# EasyEDA Pro project BLDCV6-nerdyintern.eprj, schematic Schematic2
Create Date: 2024-09-26; Page Name: P1; Project Name: BLDCV6; Schematic Name: Schematic2; Update Date: 2024-09-26; Company: EasyEDA.com; Drawn: EasyEDA; Page Size: A4; Part Number: JLCPCB-002; Reviewed: EasyEDA; Version: V0.1
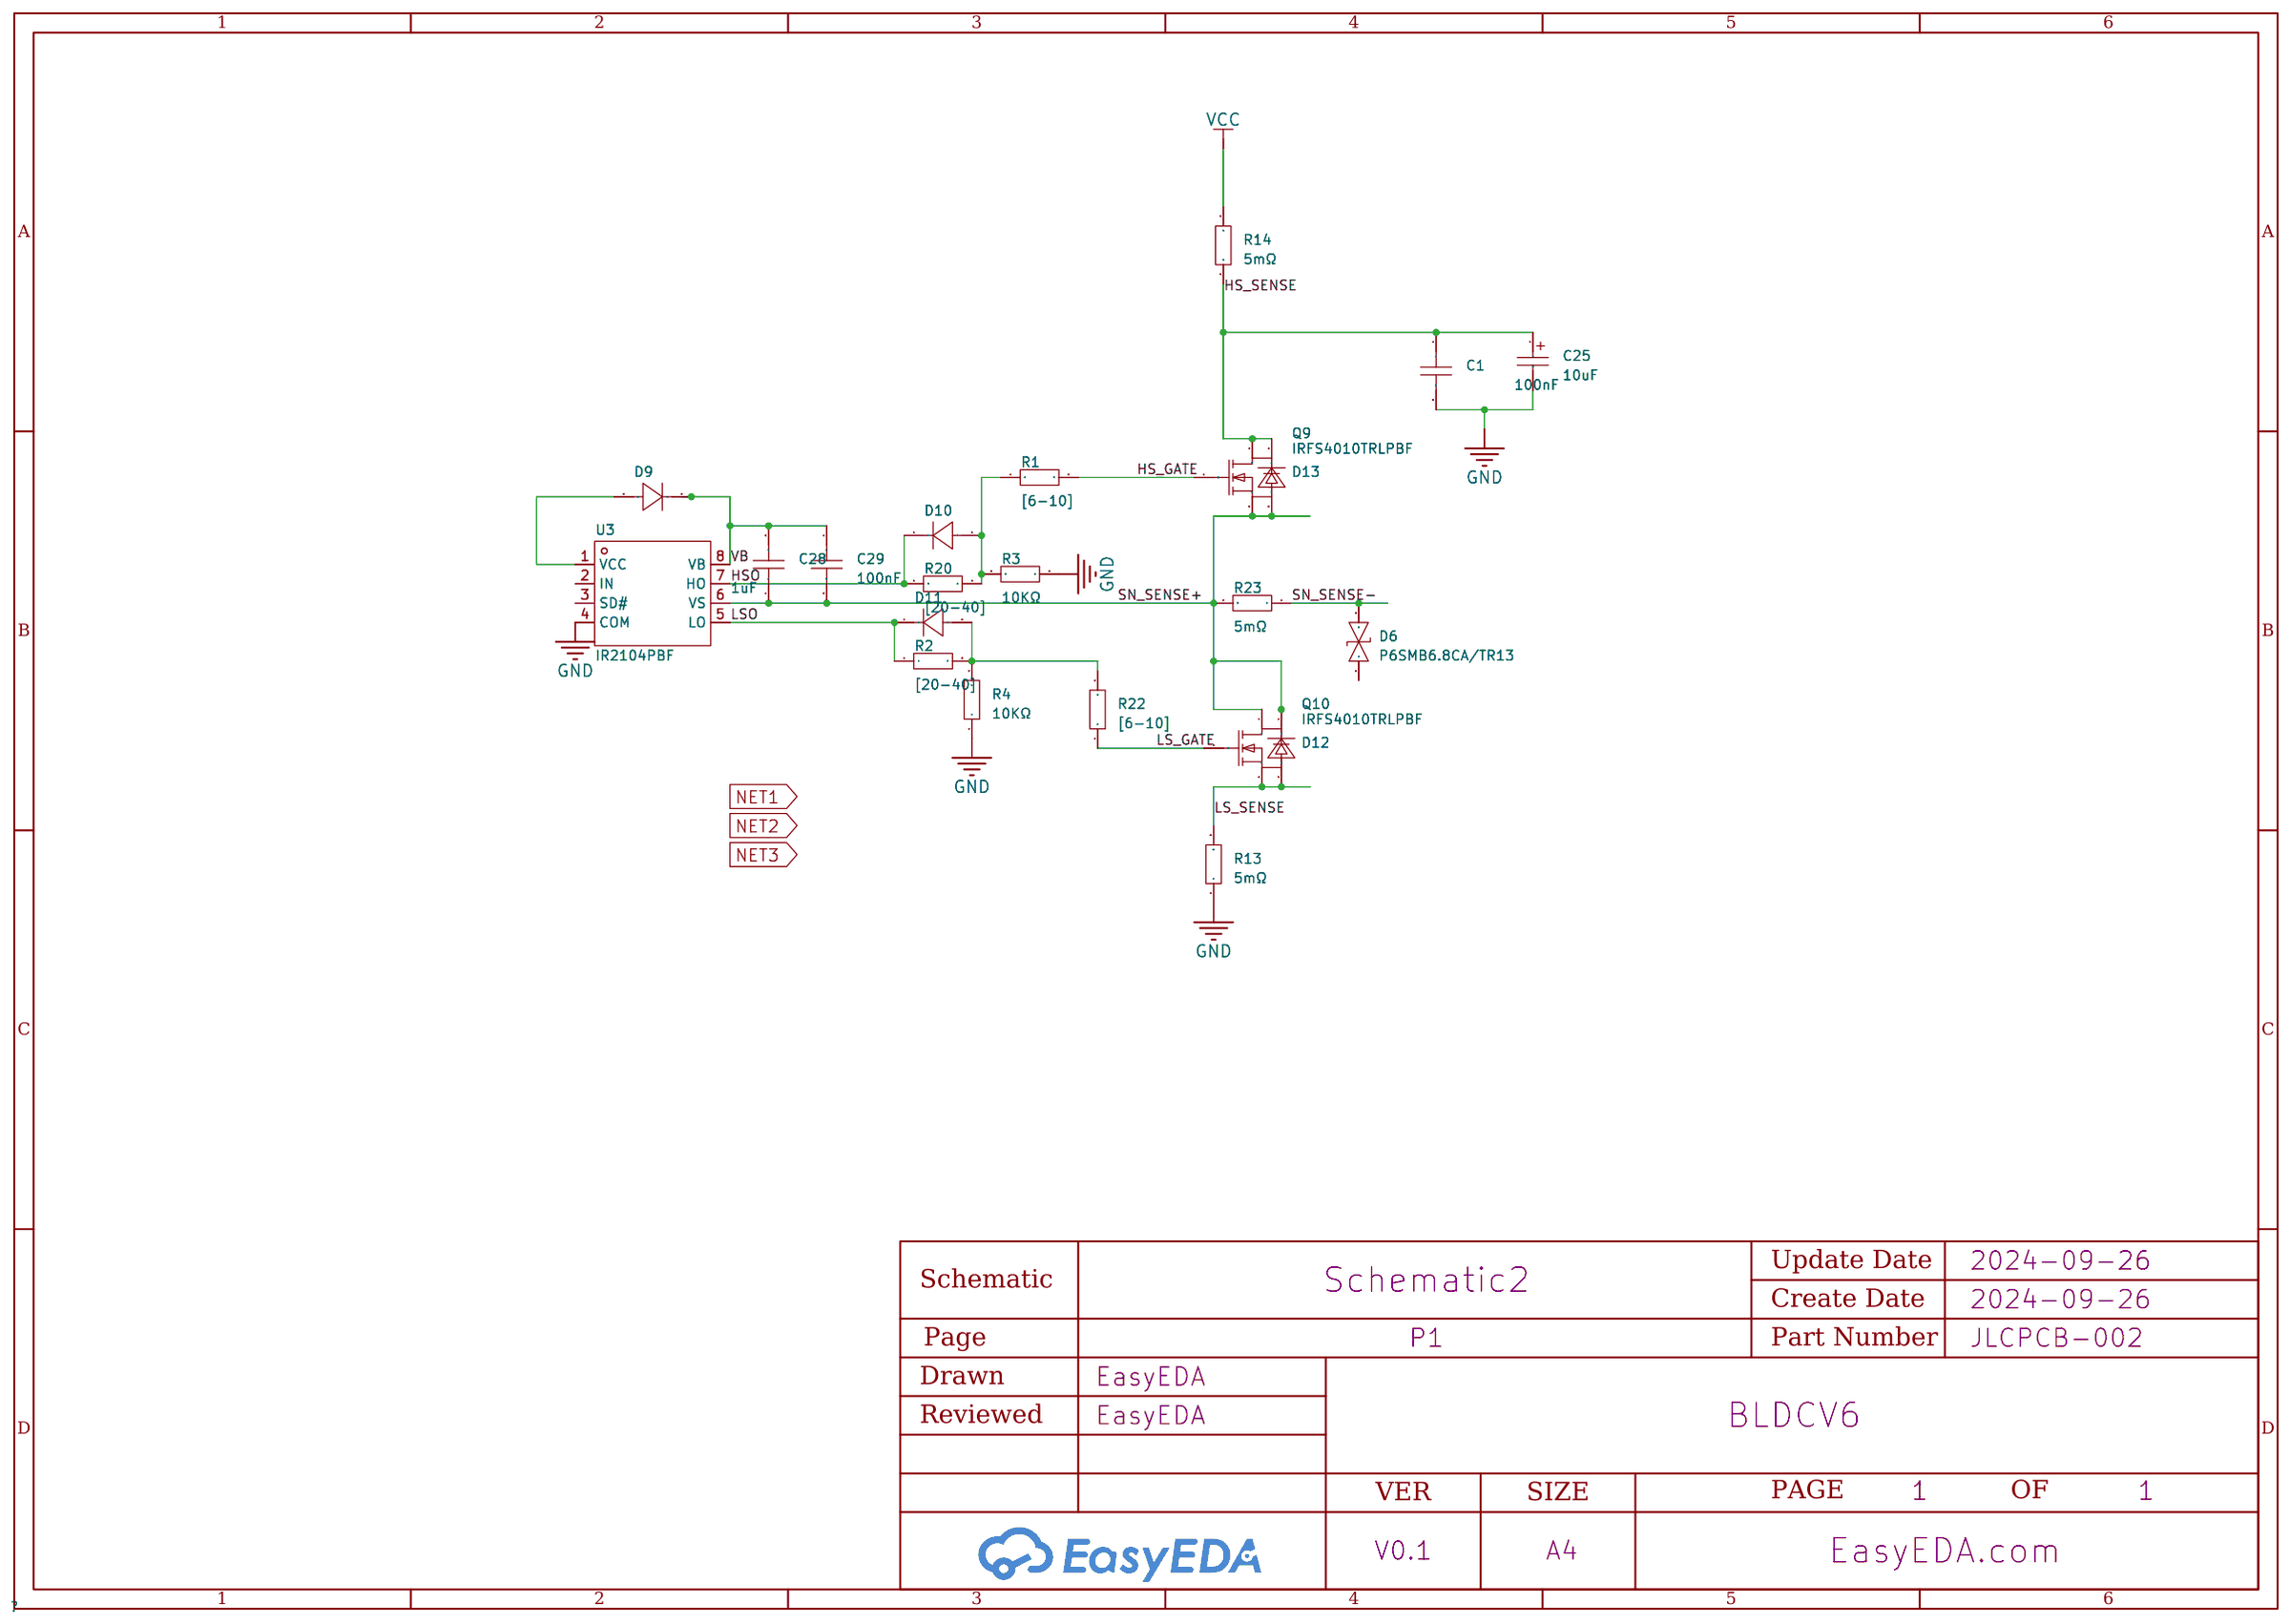
[diagram p1: schematic sheet]

## Parts
C1  100nF  [C0805]
C25  10uF  [CAP-SMD_BD5.0-L5.3-W5.3-LS6.3-FD]
C28  1uF  [CAP-TH_L7.2-W2.5-P5.00-D0.6]
C29  100nF  [C0805]
D6  P6SMB6.8CA/TR13  [SMB_L4.6-W3.6-LS5.3-BI]
D9  -  [DO-41_BD2.4-L4.7-P8.70-D0.9-RD]
D10  -  [DO-41_BD2.4-L4.7-P8.70-D0.9-RD]
D11  -  [DO-41_BD2.4-L4.7-P8.70-D0.9-RD]
D12  -  [DO-41_BD2.4-L4.7-P8.70-D0.9-RD]
D13  -  [DO-41_BD2.4-L4.7-P8.70-D0.9-RD]
Q9  IRFS4010TRLPBF  [D2PAK_L9.1-W10.0-P2.54-LS15.3-BR-1]
Q10  IRFS4010TRLPBF  [D2PAK_L9.1-W10.0-P2.54-LS15.3-BR-1]
R1  [6-10]  [R1210]
R2  [20-40]  [R1210]
R3  10KΩ  [R1210]
R4  10KΩ  [R1210]
R13  5mΩ  [R2512]
R14  5mΩ  [R2512]
R20  [20-40]  [R1210]
R22  [6-10]  [R1210]
R23  5mΩ  [R2512]
U3  IR2104PBF  [DIP-8_L9.9-W6.6-P2.54-LS7.62-BL]

## Library data of the parts
C1 C29 = CAP_0805: Supplier Footprint: 0805
C25 = C_Ele_SMD_5x5.4mm: Supplier Footprint: SMD,5x5.4mm
C28 = SMEC334J100M2: Capacitance: Tolerance:±5% Tolerance:±5% Voltage Rated:; LCSC Part Name: 330nF ±5% 100V; Supplier Part: C401104; Manufacturer: CHAMPION(全鹏); Supplier Footprint: 插件,P=5mm; JLCPCB Part Class: Extended Part; Datasheet: https://atta.szlcsc.com/upload/public/pdf/source/20190730/C401104_3330673C3D333BC9993FC47731C2A492.pdf; Supplier: LCSC; Tolerance: ±5%
D6 = P6SMB6.8CA/TR13: Reverse Stand-Off Voltage (Vrwm):5.8V Maximum Clamping Voltage:10.5V Peak Pulse Current (Ipp)@10/1000us:58.1A Peak Pulse Power Dissipation (Ppp)@10/1000us:600W Breakdown Voltage:6.45V Type:TVS; Supplier Part: C78395; Manufacturer: Brightking(君耀电子); Supplier Footprint: SMB(DO-214AA); JLCPCB Part Class: Basic Part; Datasheet: https://atta.szlcsc.com/upload/public/pdf/source/20160709/1468031879762.pdf; Supplier: LCSC; Reverse Stand-Off Voltage (Vrwm): 5.8V; Maximum Clamping Voltage: 10.5V; Peak Pulse Current (Ipp)@10/1000us: 58.1A; Peak Pulse Power Dissipation (Ppp)@10/1000us: 600W; Breakdown Voltage: 6.45V; Type: TVS
D9-D13 = 1N4007: Supplier Footprint: DO-41
Q9 Q10 = IRFS4010TRLPBF: Type:1个NChannel Drain Source Voltage (Vdss): Continuous Drain Current (Id): Power Dissipation (Pd): Drain Source On Resistance (RDS(on)@Vgs,Id):4.7mΩ@106A,10V Gate Threshold Voltage (Vgs(th)@Id):4V@250uA Total Gate Charge (Qg@Vgs):215nC@10V Input Capacita; LCSC Part Name: 1个N沟道 耐压:100V 电流:180A; Supplier Part: C538014; Manufacturer: Infineon(英飞凌); Supplier Footprint: D2PAK; JLCPCB Part Class: Extended Part; Datasheet: https://atta.szlcsc.com/upload/public/pdf/source/20200522/C538014_ECAE1AD36155800A57BA846B4DCA8F0D.pdf; Supplier: LCSC; Type: 1个NChannel; Drain Source On Resistance (RDS(on)@Vgs,Id): 4.7mΩ@106A,10V; Gate Threshold Voltage (Vgs(th)@Id): 4V@250uA; Total Gate Charge (Qg@Vgs): 215nC@10V; Input Capacitance (Ciss@Vds): 9.575nF@50V; Operating Temperature: -55℃~+175℃@(Tj)
R1-R4 R20 R22 = Res_1210: Supplier Footprint: 1210
R13 R14 R23 = PA2512FKF7W0R005E: Type:Current Sensing Resistors Resistance: Tolerance:±1% Tolerance:±1% Power(Watts): Temperature Coefficient:±100ppm/℃ Temperature Coefficient:±100ppm/℃; LCSC Part Name: 5mΩ ±1% 2W; Supplier Part: C309526; Manufacturer: YAGEO(国巨); Supplier Footprint: 2512; JLCPCB Part Class: Extended Part; Datasheet: https://atta.szlcsc.com/upload/public/pdf/source/20190227/C375693_219964CC8B3EBD36DBDF701587FA5938.pdf; Supplier: LCSC; Type: Current Sensing Resistors; Tolerance: ±1%; Temperature Coefficient: ±100ppm/℃
U3 = IR2104PBF: Driven Configuration:Half Bridge Load Type:MOSFET；IGBT Number of Drivers:2 Peak Output Current(sink):360mA Peak Output Current(source):210mA Supply Voltage:10V~20V Supply Voltage:10V~20V Rise Time:100ns Fall Time:50ns Operating Temperature:-40℃~+150℃@(Tj); LCSC Part Name: IR2104PBF 停产; Supplier Part: C2959; Manufacturer: Infineon(英飞凌); Supplier Footprint: PDIP-8; JLCPCB Part Class: Extended Part; Datasheet: https://atta.szlcsc.com/upload/public/pdf/source/20140906/1457707236579.pdf; Supplier: LCSC; Driven Configuration: Half Bridge; Load Type: MOSFET；IGBT; Number of Drivers: 2; Peak Output Current(sink): 360mA; Peak Output Current(source): 210mA; Supply Voltage: 10V~20V; Rise Time: 100ns; Fall Time: 50ns; Operating Temperature: -40℃~+150℃@(Tj)

## Nets
GND: C1.2 C25.2 R3.1 R4.1 R13.1 U3.4(COM)
VCC: R14.2
HS_GATE: Q9.1(G) R1.2
HS_SENSE: C1.1 C25.1 D13.1(K) Q9.4(D) R14.1
HSO: D10.1(K) R20.1 U3.7(HO)
LS_GATE: Q10.1(G) R22.1
LS_SENSE: D12.2(A) Q10.3(S) R13.2
LSO: D11.1(K) R2.1 U3.5(LO)
SN_SENSE+: C28.1 C29.2 D12.1(K) D13.2(A) Q9.3(S) Q10.4(D) R23.2 U3.6(VS)
SN_SENSE-: D6.2 R23.1
VB: C28.2 C29.1 D9.1(K) U3.8(VB)
$1N741: D10.2(A) R1.1 R3.2 R20.2
$1N756: D9.2(A) U3.1(VCC)
$1N1033: D11.2(A) R2.2 R4.2 R22.2

Not connected (* = marked no-connect by the designer): D6 1; U3 2(IN) 3(SD#)
